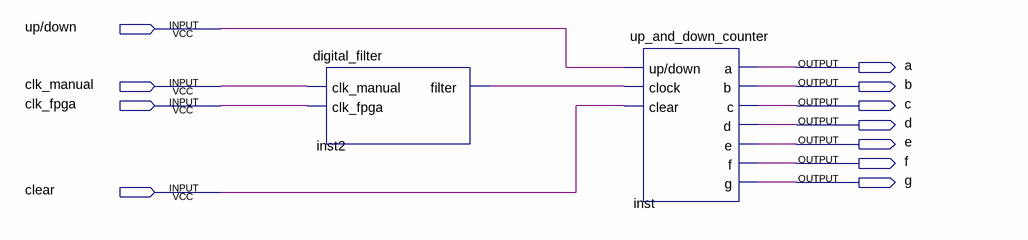
[diagram p0: schematic sheet]
// Quartus schematic filtered_up_down_counter.bdf as structural Verilog: 2 symbols, 11 pins
module filtered_up_down_counter (
  input  \up/down ,
  input  clk_manual,
  input  clk_fpga,
  input  clear,
  output a,
  output b,
  output c,
  output d,
  output e,
  output f,
  output g
);

  wire inst2_filter;

  digital_filter inst2 (.clk_manual(clk_manual), .clk_fpga(clk_fpga), .filter(inst2_filter));
  up_and_down_counter inst (
    .\up/down (\up/down ), .clock(inst2_filter), .clear(clear), .a(a), .b(b), .c(c), .d(d), .e(e), .f(f),
    .g(g));
endmodule
